# Altium schematic sheet Esquemático Principal.SchDoc: Esquemático Principal
size A4; DrawnBy: João Bortolace; Revision: 1.0; SheetNumber: 2; SheetTotal: 6
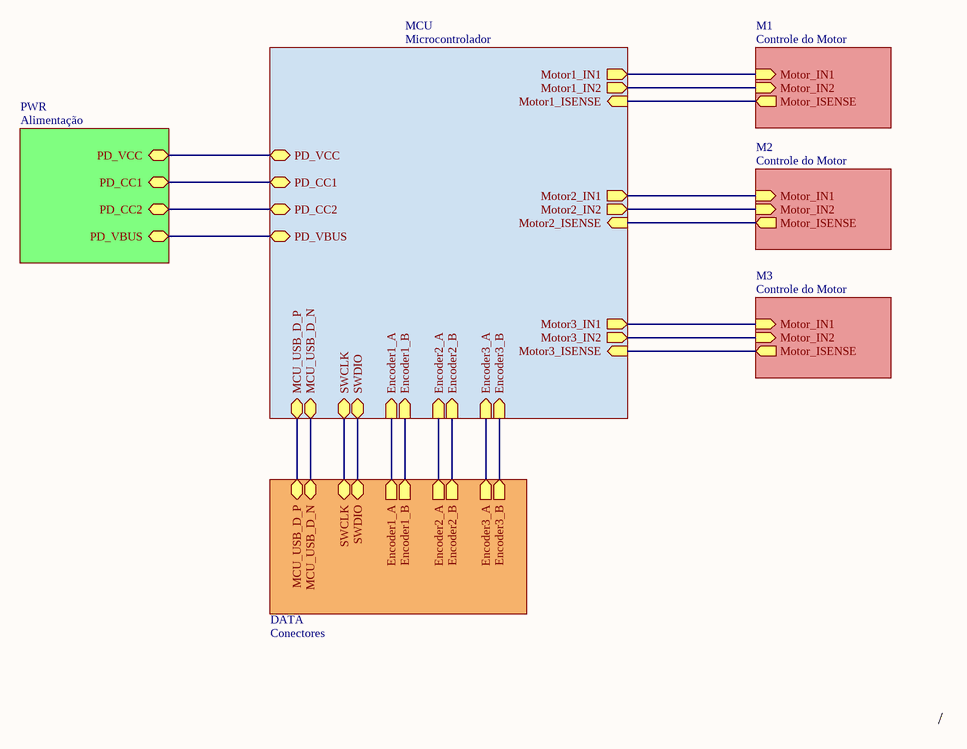
[diagram p0: Esquemático Principal.SchDoc]

## Sub-sheets
DATA = Conectores: MCU_USB_D_P (bidir), MCU_USB_D_N (bidir), SWCLK (bidir), SWDIO (bidir), Encoder1_A (out), Encoder1_B (out), Encoder2_B (out), Encoder2_A (out), Encoder3_A (out), Encoder3_B (out)
M1 = Controle do Motor: Motor_IN1 (in), Motor_IN2 (in), Motor_ISENSE (out)
M2 = Controle do Motor: Motor_IN1 (in), Motor_IN2 (in), Motor_ISENSE (out)
M3 = Controle do Motor: Motor_IN1 (in), Motor_IN2 (in), Motor_ISENSE (out)
MCU = Microcontrolador: PD_CC2 (bidir), PD_CC1 (bidir), PD_VCC (bidir), PD_VBUS (bidir), Motor1_IN1 (out), Motor1_IN2 (out), Motor1_ISENSE (in), Motor2_IN1 (out), Motor2_IN2 (out), Motor2_ISENSE (in), Motor3_IN1 (out), Motor3_IN2 (out), Motor3_ISENSE (in), MCU_USB_D_P (bidir), MCU_USB_D_N (bidir), Encoder1_A (in), Encoder1_B (in), Encoder2_B (in), Encoder2_A (in), Encoder3_A (in), Encoder3_B (in), SWCLK (bidir), SWDIO (bidir)
PWR = Alimentação: PD_CC2 (bidir), PD_CC1 (bidir), PD_VBUS (bidir), PD_VCC (bidir)

## Nets
(unnamed): sheet PWR/PD_CC2, sheet MCU/PD_CC2
(unnamed): sheet PWR/PD_CC1, sheet MCU/PD_CC1
(unnamed): sheet PWR/PD_VBUS, sheet MCU/PD_VBUS
(unnamed): sheet PWR/PD_VCC, sheet MCU/PD_VCC
(unnamed): sheet MCU/Motor1_IN1, sheet M1/Motor_IN1
(unnamed): sheet MCU/Motor1_IN2, sheet M1/Motor_IN2
(unnamed): sheet MCU/Motor1_ISENSE, sheet M1/Motor_ISENSE
(unnamed): sheet MCU/Motor2_IN1, sheet M2/Motor_IN1
(unnamed): sheet MCU/Motor2_IN2, sheet M2/Motor_IN2
(unnamed): sheet MCU/Motor2_ISENSE, sheet M2/Motor_ISENSE
(unnamed): sheet MCU/Motor3_IN1, sheet M3/Motor_IN1
(unnamed): sheet MCU/Motor3_IN2, sheet M3/Motor_IN2
(unnamed): sheet MCU/Motor3_ISENSE, sheet M3/Motor_ISENSE
(unnamed): sheet MCU/MCU_USB_D_P, sheet DATA/MCU_USB_D_P
(unnamed): sheet MCU/MCU_USB_D_N, sheet DATA/MCU_USB_D_N
(unnamed): sheet MCU/Encoder1_A, sheet DATA/Encoder1_A
(unnamed): sheet MCU/Encoder1_B, sheet DATA/Encoder1_B
(unnamed): sheet MCU/Encoder2_B, sheet DATA/Encoder2_B
(unnamed): sheet MCU/Encoder2_A, sheet DATA/Encoder2_A
(unnamed): sheet MCU/Encoder3_A, sheet DATA/Encoder3_A
(unnamed): sheet MCU/Encoder3_B, sheet DATA/Encoder3_B
(unnamed): sheet MCU/SWCLK, sheet DATA/SWCLK
(unnamed): sheet MCU/SWDIO, sheet DATA/SWDIO

## Notes on the sheet
- /